# Altium schematic sheet Mikrolysreklamen17.SchDoc
size A3
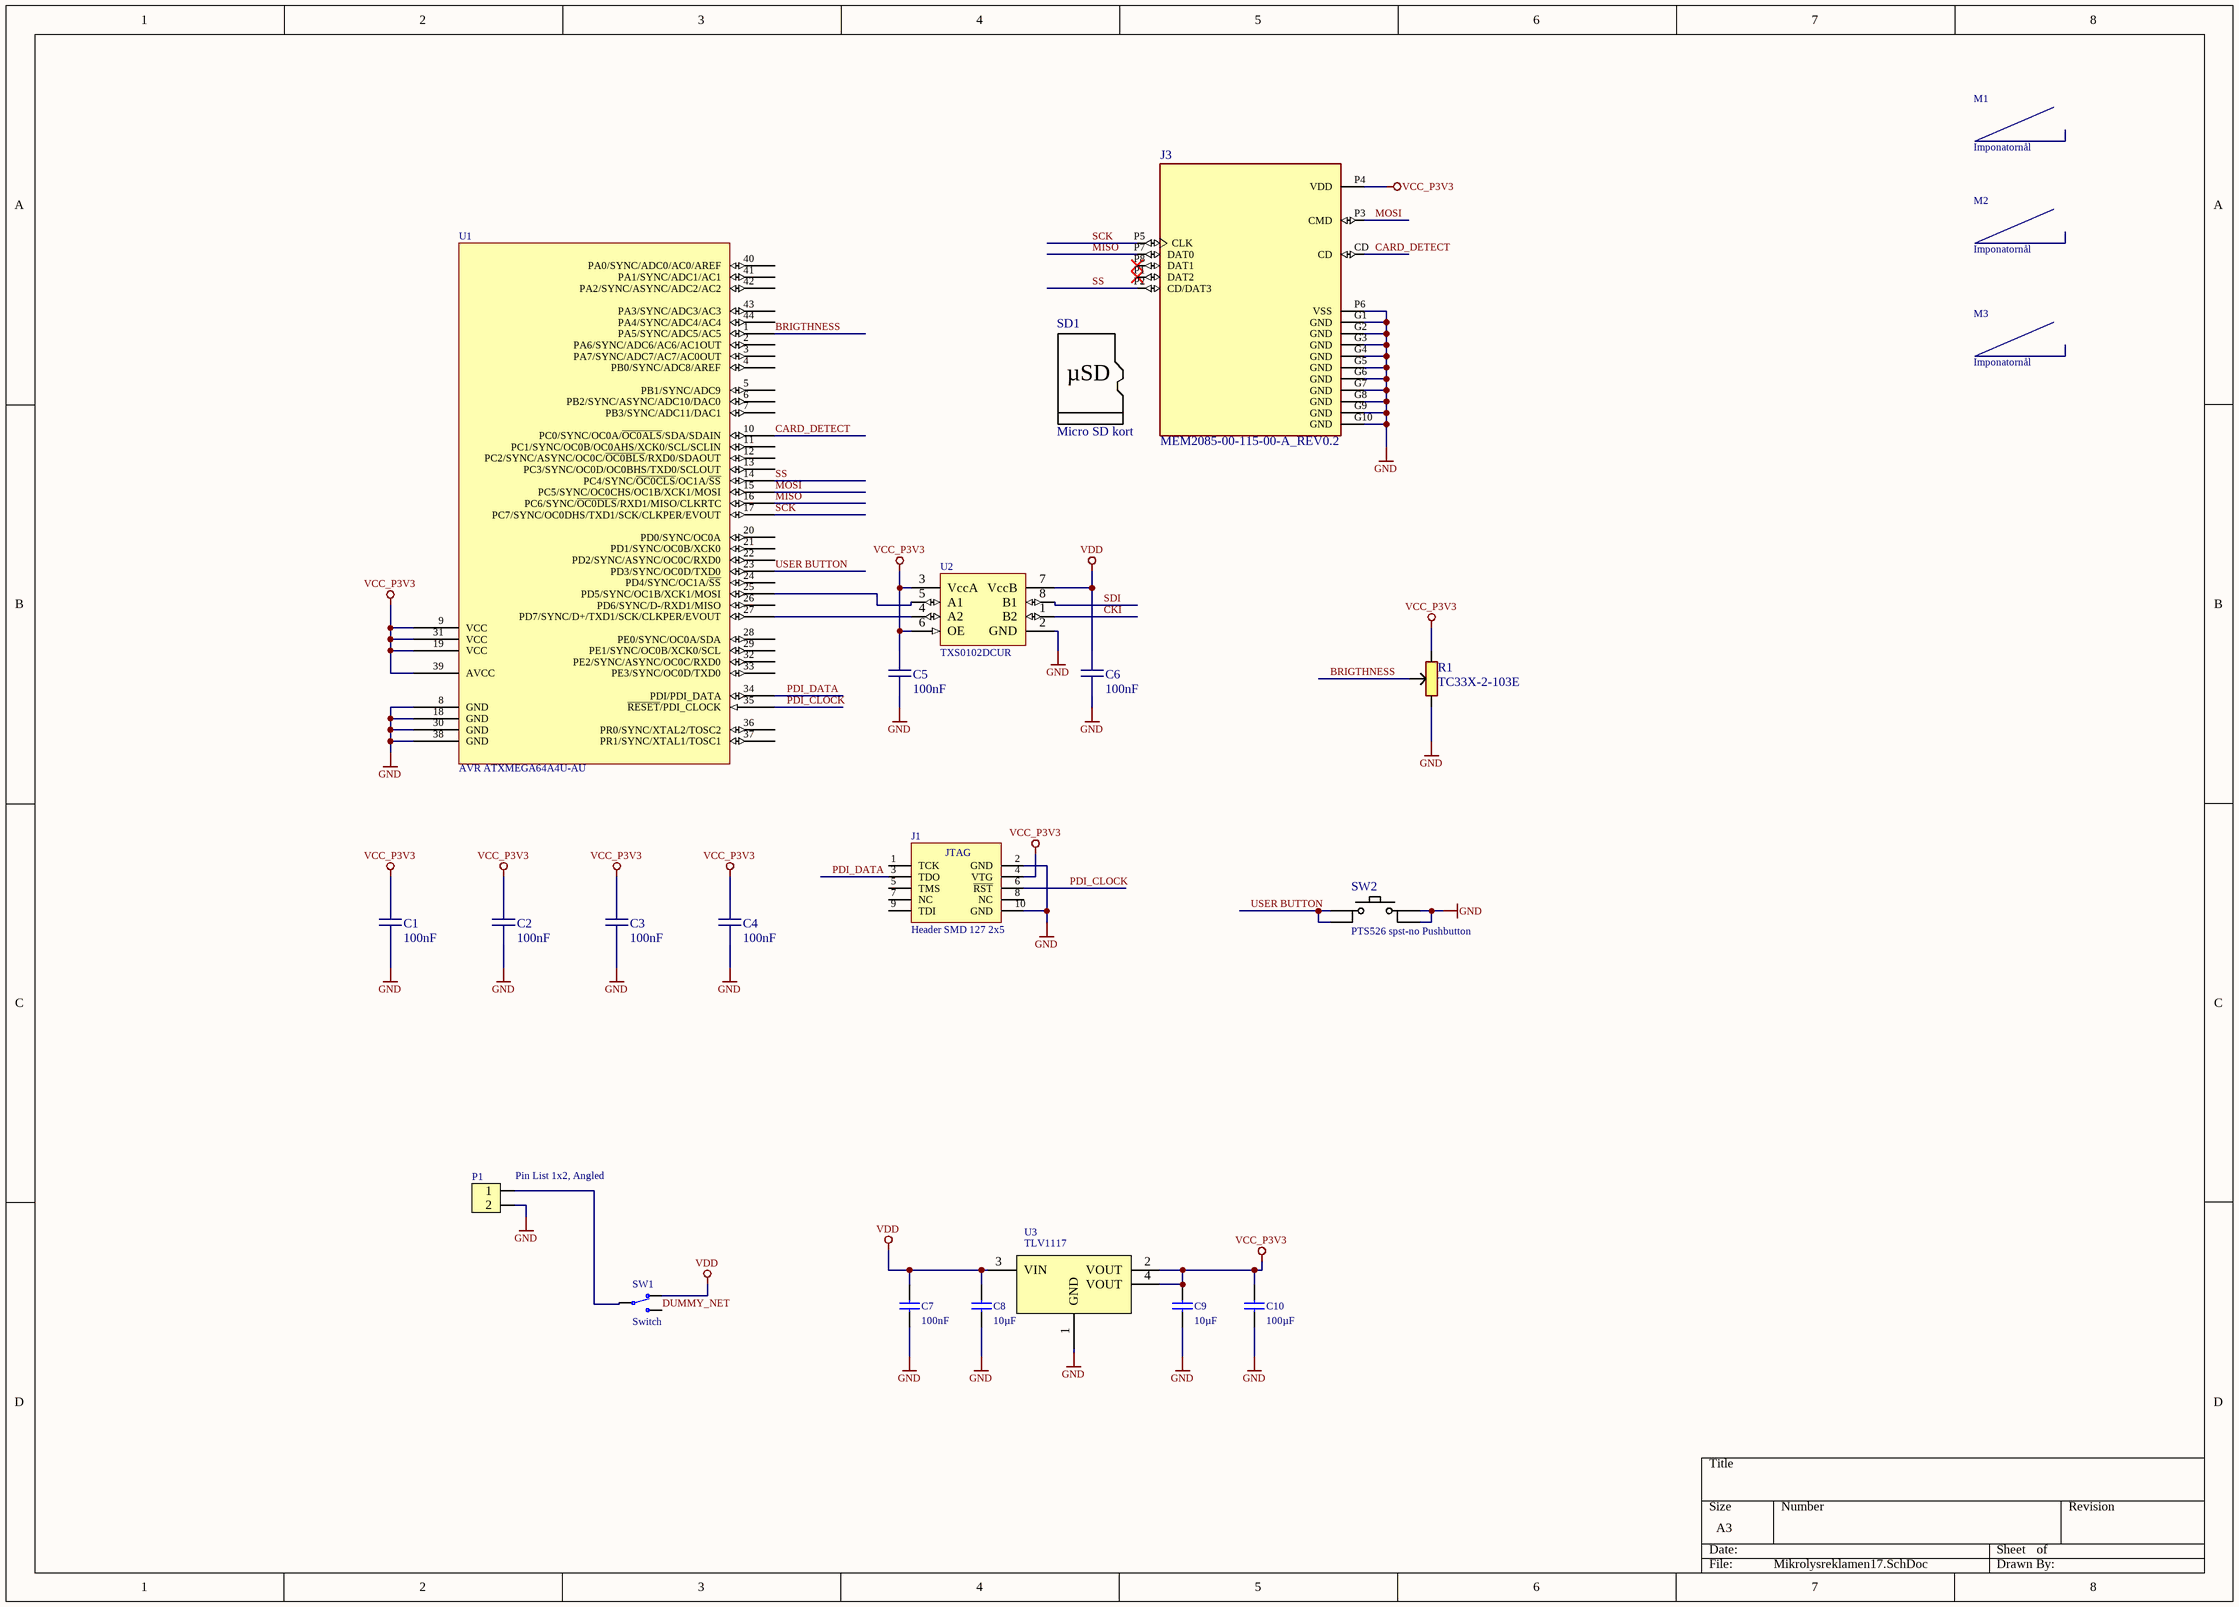
[diagram p0: Mikrolysreklamen17.SchDoc]

## Parts
C1  100nF  [CAPC0603(1608)55_N]
C2  100nF  [CAPC0603(1608)55_N]
C3  100nF  [CAPC0603(1608)55_N]
C4  100nF  [CAPC0603(1608)55_N]
C5  100nF  [CAPC0603(1608)55_N]
C6  100nF  [CAPC0603(1608)55_N]
C7  100nF  [CAPC1005X04L]
C8  10µF  [CAPC1608X06L]
C9  10µF  [CAPC1608X06L]
C10  100µF  [CAPC2012X11L]
J1  Header SMD 127 2x5  [SMDHDRV10P127_2X5_615X330X560B]
J3  MEM2085-00-115-00-A_REV0.2  [GCT_MEM2085-00-115-00-A_REV0.2]
M1  Imponatornål  [Imponatornaal_liten]
M2  Imponatornål  [Imponatornaal_liten]
M3  Imponatornål  [Imponatornaal_liten]
P1  Pin List 1x2, Angled  [LIST_ANG_1x2-SMD-2.54MM]
R1  TC33X-2-103E  [TRIM_TC33X-2-103E]
SD1  Micro SD kort  [microsdcard]
SW1  Switch  [JS102011SAQN]
SW2  PTS526 spst-no Pushbutton  [PTS526_SK15_SMTR2_LFS]
U1  AVR ATXMEGA64A4U-AU  [TQFP80P1200X1200X120-44N]
U2  TXS0102DCUR  [TSSOP50P310X90-8N]
U3  TLV1117  [SOT230P700X180-4N]

## Nets
GND: C1.1 C2.1 C3.1 C4.1 C5.1 C6.1 C7.1 C8.1 C9.1 C10.1 J1.2(GND) J1.10(GND) J3.G1(GND) J3.G2(GND) J3.G3(GND) J3.G4(GND) J3.G5(GND) J3.G6(GND) J3.G7(GND) J3.G8(GND) J3.G9(GND) J3.G10(GND) J3.P6(VSS) P1.2 R1.1 SW2.3 SW2.4 U1.8(GND) U1.18(GND) U1.30(GND) U1.38(GND) U2.2(GND) U3.1(GND)
VCC_P3V3: C1.2 C2.2 C3.2 C4.2 C5.2 C9.2 C10.2 J1.4(VTG) J3.P4(VDD) R1.3 U1.9(VCC) U1.19(VCC) U1.31(VCC) U1.39(AVCC) U2.3(VccA) U2.6(OE) U3.2(VOUT) U3.4(VOUT)
VDD: C6.2 C7.2 C8.2 SW1.1(N.C) U2.7(VccB) U3.3(VIN)
BRIGTHNESS: R1.2 U1.1(PA5/SYNC/ADC5/AC5)
CARD_DETECT: J3.CD U1.10(PC0/SYNC/OC0A/~{OC0ALS}/SDA/SDAIN)
CKI: U2.1(B2)
DUMMY_NET: SW1.3(N.O)
MISO: J3.P7(DAT0) U1.16(PC6/SYNC/~{OC0DLS}/RXD1/MISO/CLKRTC)
MOSI: J3.P3(CMD) U1.15(PC5/SYNC/OC0CHS/OC1B/XCK1/MOSI)
PDI_CLOCK: J1.6(~{RST}) U1.35(~{RESET}/PDI_CLOCK)
PDI_DATA: J1.3(TDO) U1.34(PDI/PDI_DATA)
SCK: J3.P5(CLK) U1.17(PC7/SYNC/OC0DHS/TXD1/SCK/CLKPER/EVOUT)
SDI: U2.8(B1)
SS: J3.P2(CD/DAT3) U1.14(PC4/SYNC/~{OC0CLS}/OC1A/~{SS})
USER BUTTON: SW2.1 SW2.2 U1.23(PD3/SYNC/OC0D/TXD0)
NetP1_1: P1.1 SW1.2(COM)
NetU1_25: U1.25(PD5/SYNC/OC1B/XCK1/MOSI) U2.5(A1)
NetU1_27: U1.27(PD7/SYNC/D+/TXD1/SCK/CLKPER/EVOUT) U2.4(A2)

Not connected (* = marked no-connect by the designer): J1 1(TCK) 5(TMS) 7(NC) 8(NC) 9(TDI); J3 P1(DAT2)* P8(DAT1)*; U1 2(PA6/SYNC/ADC6/AC6/AC1OUT) 3(PA7/SYNC/ADC7/AC7/AC0OUT) 4(PB0/SYNC/ADC8/AREF) 5(PB1/SYNC/ADC9) 6(PB2/SYNC/ASYNC/ADC10/DAC0) 7(PB3/SYNC/ADC11/DAC1) 11(PC1/SYNC/OC0B/OC0AHS/XCK0/SCL/SCLIN) 12(PC2/SYNC/ASYNC/OC0C/~{OC0BLS}/RXD0/SDAOUT) 13(PC3/SYNC/OC0D/OC0BHS/TXD0/SCLOUT) 20(PD0/SYNC/OC0A) 21(PD1/SYNC/OC0B/XCK0) 22(PD2/SYNC/ASYNC/OC0C/RXD0) 24(PD4/SYNC/OC1A/~{SS}) 26(PD6/SYNC/D-/RXD1/MISO) 28(PE0/SYNC/OC0A/SDA) 29(PE1/SYNC/OC0B/XCK0/SCL) 32(PE2/SYNC/ASYNC/OC0C/RXD0) 33(PE3/SYNC/OC0D/TXD0) 36(PR0/SYNC/XTAL2/TOSC2) 37(PR1/SYNC/XTAL1/TOSC1) 40(PA0/SYNC/ADC0/AC0/AREF) 41(PA1/SYNC/ADC1/AC1) 42(PA2/SYNC/ASYNC/ADC2/AC2) 43(PA3/SYNC/ADC3/AC3) 44(PA4/SYNC/ADC4/AC4)

## Notes on the sheet
- (in symbol 3019) µSD

## Library data of the parts
C1-C6 = 5152: pakke_opprettet_av: 815; leverandor_varenr: 1759122; pris: 1; nokkelord: Kondensator, Capacitor, CAP; pakketype: 0603; produsent: Multicomp; leverandor: Farnell; id: 5152; rad: 21; rom: OV; lager_type: Baklager; dybde: 0; antall: 985; beskrivelse: X7R 50V 5%; komponenttype: 2; navn: 100nF; pakke_opprettet: 18/02/2015 14:18:13; symbol_opprettet_av: 815; symbol_opprettet: 14/11/2014 20:19:34; hylle: 0; elektrisk_verdi: 100nF
C7 = C0402-100n: Capacitor, X7R, ±10%; Note: 16V; Artikkelnr Noca: 20039200; Artikkelnr Simpro: N.A.; Part Number: C0402-100n; Manufacturer: *; Manufacturer Part Number: *; Datasheet: *; Footprint Doc: 0402; LatestRevisionDate: 2009-11-23; Pin Count: 2; Publisher: Nordic Semiconductor; Published: 2009-05-08; Value: 100nF; Supplier: *; Supplier part number: *; 2nd source Supplier: *; 2nd source part number: *
C8 C9 = C0603-10µ: Capacitor, X5R, ±20%; Note: 6.3V; Artikkelnr Noca: 20039234; Artikkelnr Simpro: N.A.; Part Number: C0603-10µ; Manufacturer: *; Manufacturer Part Number: *; Datasheet: *; Footprint Doc: 0603; LatestRevisionDate: 2011-01-17; Pin Count: 2; Publisher: Nordic Semiconductor; Published: 2011-01-17; Value: 10µF; Supplier: *; Supplier part number: *; 2nd source Supplier: *; 2nd source part number: *
C10 = C0805-TBD: Chip Cap 0805; Artikkelnr Noca: N.A.; Part Number: C0805-TBD; Manufacturer: *; Manufacturer Part Number: *; Datasheet: *; Footprint Doc: 0805; LatestRevisionDate: 2013-12-17; Pin Count: 2; Publisher: Nordic Semiconductor; Published: 2013-12-17; Value: 100µF; Note: Chip Cap; Supplier: *; Supplier part number: *; 2nd source Supplier: *; 2nd source part number: *; Artikkelnr Simpro: N.A.
J1 = 2449: 1,27mm Pitch SMD Header; id: 2449; pakke_opprettet_av: 815; pris: 20; nokkelord: JTAG; pakketype: 101; pakke_opprettet: 15.11.2014 18:30:38; symbol_opprettet_av: 815; symbol_opprettet: 15.11.2014 18:33:29; navn: Header SMD 127 2x5
J3 = 6893: MicroSD Push pull Memory Card Connector; MF: Global Connector Technology; id: 6893; pakke_opprettet_av: 815; beskrivelse: MICRO SD PUSH-PULL SMT 1.15MM; leverandor_varenr: 2073-MEM2085-00-115-00-ACT-ND; navn: MEM2085 microSDcardHolder; pris: 12; nokkelord: sdcard, microsd; produsent: GCT; leverandor: DigiKey; pakketype: SMD; komponenttype: 11; Package: None; Availability: Not in stock; SnapEDA_Link: https://www.snapeda.com/parts/MEM2085-00-115-00-A/Global+Connector+Technology/view-part/?ref=snap; MP: MEM2085-00-115-00-A; Price: None; Value: *; Check_prices: https://www.snapeda.com/parts/MEM2085-00-115-00-A/Global+Connector+Technology/view-part/?ref=eda; pakke_opprettet: 16/04/2023 02:33:45; symbol_opprettet_av: 815; symbol_opprettet: 16/04/2023 02:35:20; produsent_varenr: MEM2085-00-115-00-A
M1-M3 = 3331: nål til imponatorplate 20mm (Brooch back); id: 3331; rad: 0; rom: OV; lager_type: Fremlager; dybde: 1; hylle: 4; antall: 41; pakke_opprettet_av: 815; leverandor_varenr: 600721; pris: 5; nokkelord: cchobby.no; produsent: Jewellery Maker; pakketype: SMD; pakke_opprettet: 15.11.2018 22:49:40; symbol_opprettet_av: 815; symbol_opprettet: 23.10.2015 21:10:45; navn: Imponatornål
P1 = Pin List Ang 1x2 SMD, 2.54mm: Pin List 1x2, 2.54mm (100mil), Right Angled, SMD; Manufacturer: W-CON; Manufacturer Part Number: 1125B-1102S0Z135R2; Part number IPS: N.A.; Artikkelnr Noca: 55010023; Part Number: Pin List Ang 1x2 SMD, 2.54mm; ComponentLink1URL: *; ComponentLink1Description: Datasheet; ComponentLink2URL: *; ComponentLink2Description: Supplier link; HelpURL: \\hizz\pro\app9717\Datasheet\connectores\W-CON\1125B-11XXXXZXXXXX.pdf; Footprint Doc: LIST_ANG_1x2-SMD-2.54MM; LatestRevisionDate: 2016-05-26; Pin Count: 2; Publisher: Nordic Semiconductor; Published: 2016-01-22; Value: Pin List 1x2, Angled; Note: *; Supplier 1: Cabcon; Supplier Part Number 1: 1125B-1102S0Z135R2; Supplier 2: Samtec; Supplier Part Number 2: TSM-102-01-L-SH-A
R1 = 6892: id: 6892; pakke_opprettet_av: 815; beskrivelse: SMD Trimpot; leverandor_varenr: TC33X-103ECT-ND; pris: 4; nokkelord: potentiometer, potmeter, trim, resistor; produsent: Bourns; elektrisk_verdi: 10k; leverandor: DigiKey; pakketype: SMD; komponenttype: 1; pakke_opprettet: 16/04/2023 02:23:24; symbol_opprettet_av: 815; symbol_opprettet: 03/11/2016 15:34:07; navn: TC33X-2-103E; produsent_varenr: TC33X-2-103E
SD1 = 3019: id: 3019; rad: 3; rom: OV; lager_type: Baklager; dybde: 1; antall: -1; pakke_opprettet_av: 815; pris: 70; nokkelord: SD, minnekort; hylle: 3; pakke_opprettet: 16/04/2023 02:41:18; symbol_opprettet_av: 815; symbol_opprettet: 16/04/2023 02:41:09; navn: Micro SD kort
SW1 = JS102011SAQN: SMD slide Switch (ON-ON); Manufacturer: C&K Components; Part number IPS: N.A.; Artikkelnr Noca: 50019064; Part Number: JS102011SAQN; Manufacturer Part Number: JS102011SAQN; ComponentLink1URL: *; ComponentLink1Description: Datasheet; ComponentLink2URL: *; ComponentLink2Description: Supplier link; HelpURL: http://www.ck-components.com/14398/js_14july11.pdf/; Footprint Doc: JS102011SAQN; LatestRevisionDate: 2011-08-15; Pin Count: 3; Publisher: Nordic Semiconductor; Published: 2011-08-15; Value: Switch; Note: *; Supplier 1: Digi-Key; Supplier Part Number 1: 401-1999-1-ND; Supplier 2: Mouser; Supplier Part Number 2: 611-JS102011SAQN
SW2 = 6894: id: 6894; pakke_opprettet_av: 815; beskrivelse: Tactile SMD pushbutton 5.2x5.2mm 1.5mmh, 260gf, spst-no; leverandor_varenr: CKN12221-1-ND; pris: 2; nokkelord: knapp, button, tactile, spst-no; produsent: C&K; produsent_varenr: PTS526 SK15 SMTR2 LFS; leverandor: DigiKey; pakketype: SMD; komponenttype: 12; pakke_opprettet: 16/04/2023 03:26:55; symbol_opprettet_av: 815; symbol_opprettet: 14/11/2014 21:57:30; navn: PTS526 spst-no Pushbutton
U1 = 2103: Mikrokontroller; id: 2103; rad: 4; rom: OV; lager_type: Fremlager; dybde: 0; antall: 75; kolonne: 2; pakke_opprettet_av: 774; pakketype: 45; produsent: Atmel; hylle: 0; pakke_opprettet: 22.08.2014 14:00:28; symbol_opprettet_av: 774; symbol_opprettet: 22.08.2014 14:00:55; navn: AVR ATXMEGA64A4U-AU; pris: 0
U2 = TXS0102DCUR: IC VOLT-LEVEL TRANSLATOR 8-US8; Manufacturer: Texas Instruments; Note: TEXAS INSTRUMENTS - TXS0102DCUR - IC, TRANSLATOR; Artikkelnr Noca: N.A.; Part Number: TXS0102DCUR; Manufacturer Part Number: TXS0102DCUR; ComponentLink1URL: *; ComponentLink1Description: Datasheet; ComponentLink2URL: *; ComponentLink2Description: Supplier link; HelpURL: http://www.ti.com/lit/ds/symlink/txs0102.pdf; Footprint Doc: 8-VFSOP; LatestRevisionDate: 2012-09-06; Pin Count: 8; Publisher: Nordic Semiconductor; Published: 2012-09-06; Value: TXS0102DCUR; Supplier 1: Digi-Key; Supplier Part Number 1: 296-21931-1-ND; Supplier 2: Farnell; Supplier Part Number 2: 170-3315; Part number IPS: N.A.
U3 = TLV1117-33CDCYR: REG LDO 3.3V 0.8A SOT223; Manufacturer: Texas Instruments; Artikkelnr Noca: N.A.; Part Number: TLV1117-33CDCYR; Manufacturer Part Number: TLV1117-33CDCYR; ComponentLink1URL: http://www.ti.com/lit/ds/symlink/tlv1117.pdf; ComponentLink1Description: Datasheet; ComponentLink2URL: *; ComponentLink2Description: Supplier link; HelpURL: *; Footprint Doc: SOT-223; LatestRevisionDate: 2018-08-10; Pin Count: 4; Publisher: Nordic Semiconductor; Published: 2018-08-10; Value: TLV1117; Note: *; Supplier 1: Digi-Key; Supplier Part Number 1: 296-21112-1-ND; Supplier 2: *; Supplier Part Number 2: *; Part number IPS: N.A.